# EAGLE design nled-triangle-ap102-pixel-panel-v1a (EAGLE 8.6.0)
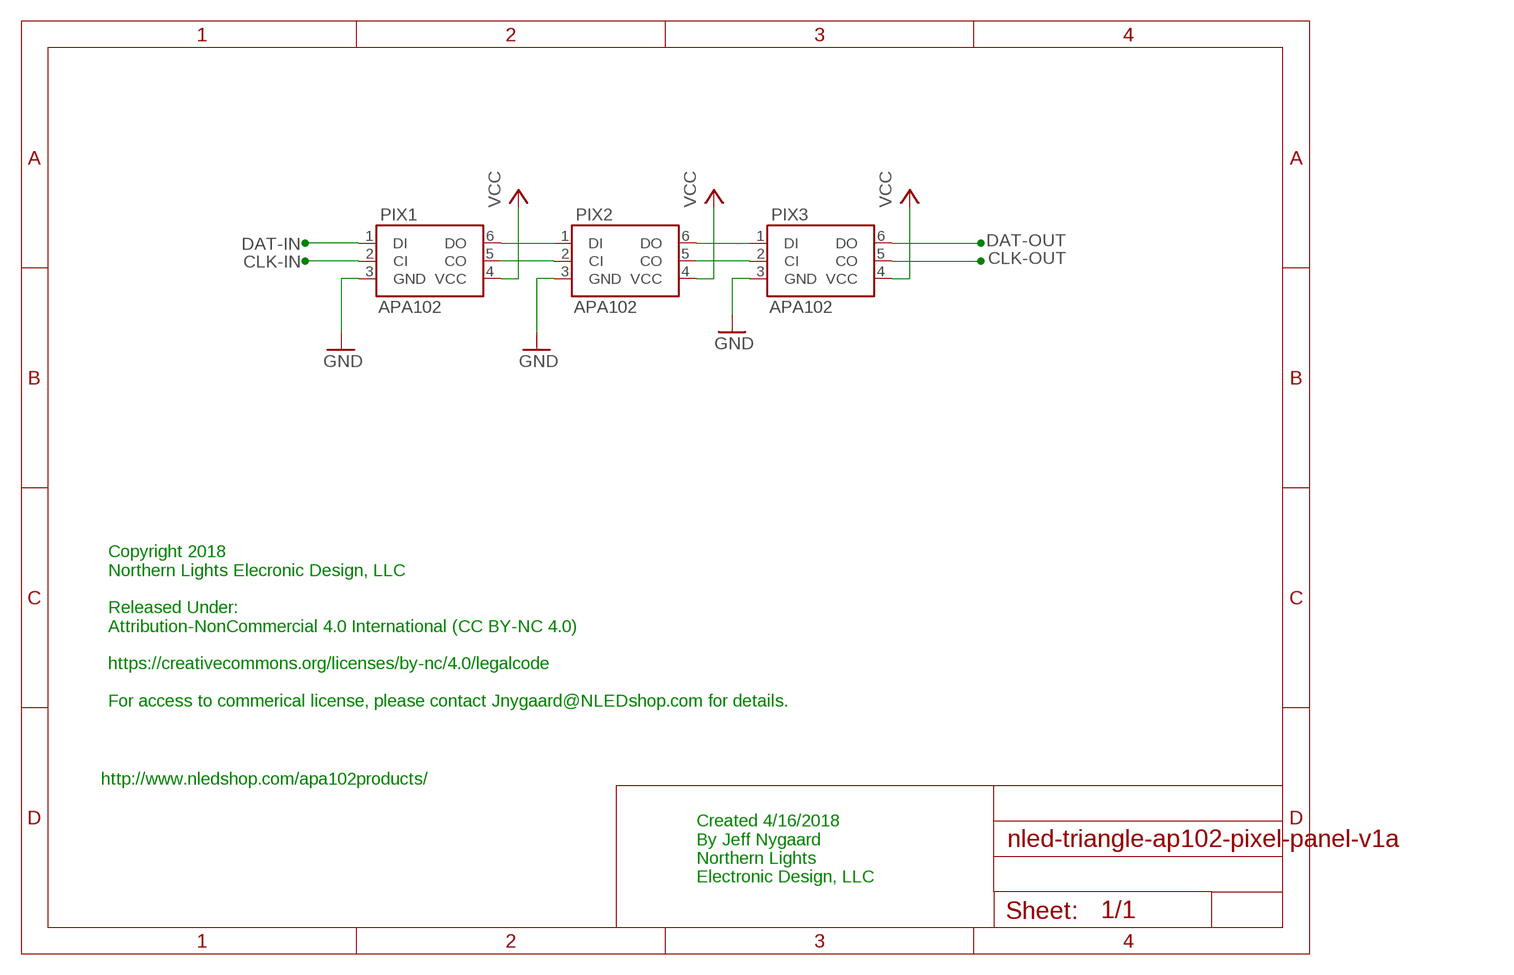
[diagram p0: schematic, sheet 1]

## Parts
PIX1  APA102  [APA102]
PIX2  APA102  [APA102]
PIX3  APA102  [APA102]

## Nets
CLK-IN: PIX1.2(CI)
CLK-OUT: PIX3.5(CO)
DAT-IN: PIX1.1(DI)
DAT-OUT: PIX3.6(DO)
GND: PIX1.3(GND) PIX2.3(GND) PIX3.3(GND)
N$1: PIX1.6(DO) PIX2.1(DI)
N$2: PIX1.5(CO) PIX2.2(CI)
N$6: PIX2.6(DO) PIX3.1(DI)
N$7: PIX2.5(CO) PIX3.2(CI)
VCC: PIX1.4(VCC) PIX2.4(VCC) PIX3.4(VCC)

## Notes on the sheet
- Copyright 2018
  Northern Lights Elecronic Design, LLC
  
  Released Under:
  Attribution-NonCommercial 4.0 International (CC BY-NC 4.0)
  
  https://creativecommons.org/licenses/by-nc/4.0/legalcode
  
  For access to commerical license, please contact Jnygaard@NLEDshop.com for details.
- http://www.nledshop.com/apa102products/
- Created 4/16/2018
  By Jeff Nygaard
  Northern Lights
  Electronic Design, LLC

## Library data of the parts
PIX1-PIX3 = ChromationSystems-2:APA102

## Net classes
0 default: width 0.61 mm

## Board
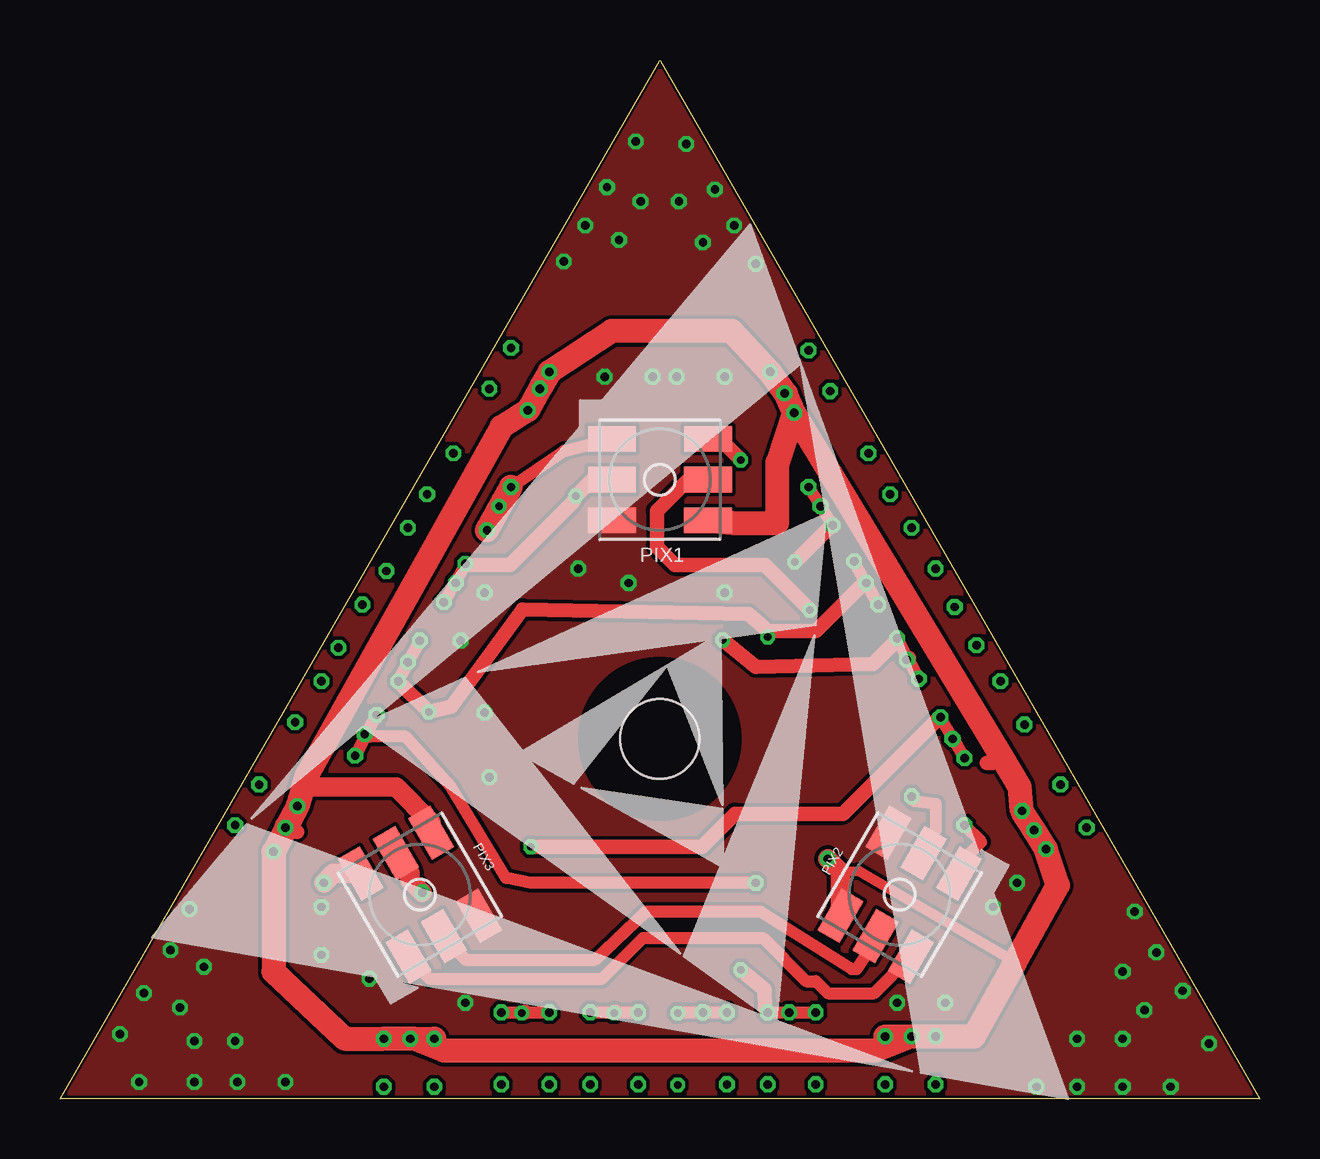
[diagram p1: board, top side]
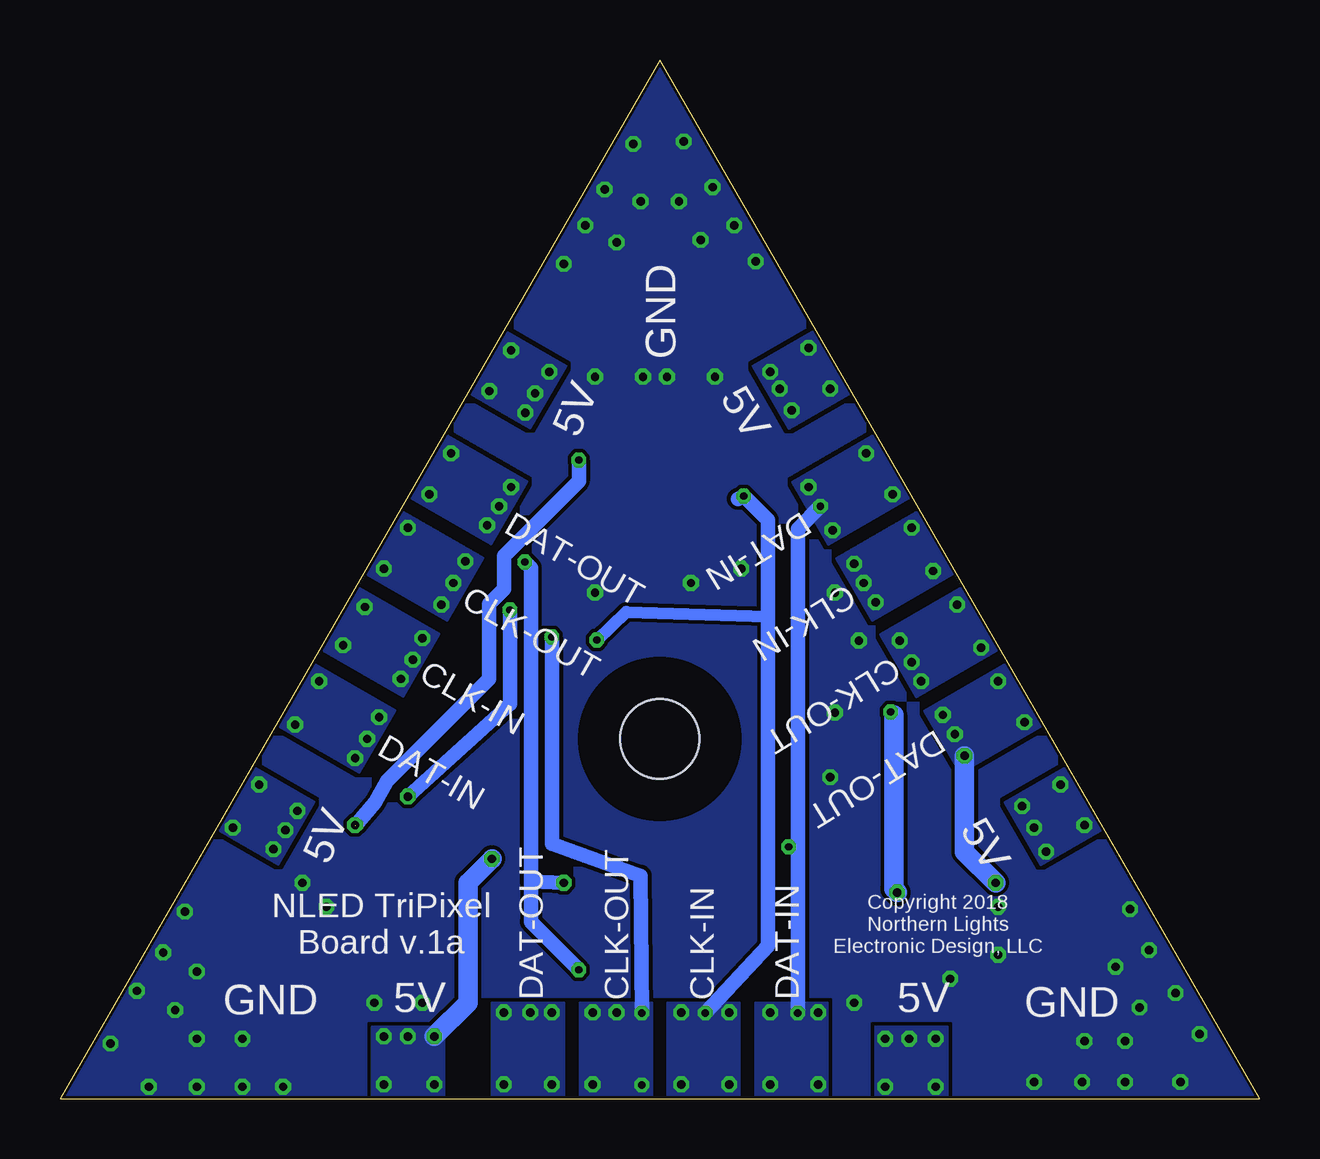
[diagram p2: board, bottom side, seen from below]

Size 50 x 43.3 mm. Coordinates in mm from the lower left corner, seen from the top.
Outline: 25,43.3 50,0 0,0 25,43.3
Copper layers (1*16): Top 0.035mm / dielectric 1.5mm / Bottom 0.035mm
Design rules "SeeedStudio_2layer_DRU_no_angle_20140221 *": minimum track width 6mil, minimum drill 12mil, track to track 6mil, track to pad 6mil, pad to pad 6mil, via to via 6mil, smd to smd 0mil, copper to edge 5mil, drill to drill 10mil, minimum pad ring 10mil, minimum via ring 6mil, stop-mask expansion 2mil, vias tented up to drill 100mil, thermal gap 10mil
Holes 3.3 mm at 25,15
tRestrict: area 21.8,11.8 to 28.2,18.2
bRestrict: area 21.8,11.8 to 28.2,18.2

### Footprints (pad centres in the part's own frame; a part is rotated, then mirrored left to right if it is on the bottom)
APA102 = smd 2 x 1.067: 1 -2,1.7; 2 -2,0; 3 -2,-1.7; 4 2,-1.7; 5 2,0; 6 2,1.7

### Placement (x,y rotation side)
PIX1  25,25.81 0 top
PIX2  35,8.51 240 top
PIX3  15,8.51 120 top

### Tracks (layer width: path | path; a pad name or v marks a point on that pad's centre or on a via)
CLK-IN  (via drill 0.3, 0.35)
  Top 0.508: v16,20.7 16.46,21.52 v16.9,22.3 | v22.1,3.6 23.1,3.6 | 23.12,3.6 v24.1,3.6 | v35.8,17.5 35.34,18.36 v34.9,19.2
  Top 0.61: v35.3,18.3 35.38,18.38 35.34,18.36 | v16.5,21.5 16.46,21.52 | 23.12,3.62 23.1,3.6 | PIX1.2 23,25.88 22.25,25.88 v21.5,25.12 21.38,24.88 18.75,22.25 17.12,22.25 v16.9,22.3 | v27.62,19.12 29,18 33.88,18.12 34.75,19 v34.9,19.2
  Bottom 0.508: v27.62,19.12 26.4,20.3 20.5,20.11
  Bottom 0.61: v23.1,3.58 20.5,6.38 20.5,20.11 20.5,24.12 v21.5,25.12 21.75,25
  other vias: 22.1,0.6 24.1,0.6 38.2,18.9 37.3,20.5 14.5,23.8 13.6,22
  pour Bottom: 24.67,0 21.67,0 21.67,4 24.67,4
  pour Bottom: 37.67,21.37 39.17,18.77 35.7,16.77 34.2,19.37
  pour Bottom: 12.68,21.93 14.18,24.53 17.64,22.53 16.14,19.93
CLK-OUT  (via drill 0.3, 0.35)
  Top 0.508: v14.1,17.4 14.54,18.23 v15,19.1 | 25.8,3.6 v26.8,3.6 26.88,3.6 v27.8,3.6 | v33.1,22.4 v33.6,21.5 v33.61,21.49 v34.1,20.6
  Top 0.61: v26.8,3.6 26.88,3.62 26.88,3.6 | v33.61,21.49 33.62,21.5 v33.6,21.5 33.38,21.38 31.5,19.5 29.5,19.5 | v14.5,18.2 14.5,18.25 14.54,18.23 | v14.1,17.4 v15.38,16.12 16.32,16.35 19.27,20.4 28.7,20.2 29.5,19.5 | v29.5,19.25 29.5,19.5
  Top 0.813: PIX3.5 14,10 14.6,9.4 14.6,9.1 v15.1,8.6
  Bottom 0.61: v15.38,16.12 15.25,16 | v25.75,3.58 25.8,9.3 29.5,10.62 v29.5,19.25
  Bottom 0.813: 15.25,16 15.25,8.75 v15.1,8.6
  other vias: 25.75,0.57 27.8,0.6 36.5,22.1 35.5,23.8 12.6,20.6 11.6,18.8
  pour Bottom: 28.33,0 25.33,0 25.33,4 28.33,4
  pour Bottom: 35.83,24.55 37.33,21.95 33.87,19.95 32.37,22.54
  pour Bottom: 10.84,18.75 12.34,21.35 15.81,19.35 14.31,16.75
DAT-IN  (via drill 0.3, 0.35)
  Top 0.508: v18.8,25.5 21,27 PIX1.1 | v18.4,3.6 19.4,3.6 v20.4,3.6 | v37.7,14.2 37.23,14.99 v36.7,15.9
  Top 0.61: v37.2,15 37.25,15 37.23,14.99 | 19.38,3.62 19.4,3.6 v19.25,3.58 | v19.62,10.5 26.75,10.5 28.12,11.88 32.62,11.88 36.5,15.75 v36.7,15.9
  Top 1: v17.8,23.7 v18.8,25.5
  Bottom 0.61: 19.25,10.5 19.25,23.75 v18.3,24.7 | 19.25,10.5 v19.25,3.58 | v19.62,10.5 19.25,10.5
  other vias: 18.4,0.6 20.4,0.6 40.2,15.6 39.2,17.4 16.4,26.9 15.3,25.2
  pour Bottom: 21,0 18,0 18,4 21,4
  pour Bottom: 39.5,18.19 41,15.6 37.54,13.6 36.04,16.19
  pour Bottom: 14.51,25.1 16.01,27.7 19.47,25.7 17.97,23.1
DAT-OUT  (via drill 0.3, 0.35)
  Top 0.508: 12.79,15.23 v12.3,14.3 | 12.79,15.23 v13.2,16 | v29.5,3.6 30.38,3.6 v30.4,3.6 v31.5,3.6 | v31.2,25.5 31.69,24.71 v31.7,24.7 v32.2,23.9 | v29,9 19.6,9 18.6,9.2 16.3,13 14.4,15.1 12.92,15.1 12.79,15.23
  Top 0.61: v12.7,15.2 12.75,15.25 12.79,15.23 | v31.7,24.7 31.75,24.75 31.69,24.71 | v30.4,3.6 30.38,3.62 30.38,3.6 | 28.38,5.35 29.36,4.56 | 29.36,4.56 29.38,3.75 v29.5,3.6 | v30.62,22.38 32,23.75 v32.2,23.9 | v28.38,5.38 29.36,4.56 | 12.32,14.38 v12.3,14.3
  Top 0.813: PIX3.6 11.39,9.39 v11,9
  Bottom 0.61: v30.62,22.38 30.38,22.12 30.38,9.06 | 30.38,9.06 30.38,7.38 v28.38,5.38 | v29,9 30.38,9.06
  Bottom 0.813: v12.3,14.3 12.3,10.3 v11,9
  other vias: 29.5,0.6 31.5,0.6 34.6,25.2 33.7,26.9 9.8,15.7 10.9,17.4
  pour Bottom: 32,0 29,0 29,4 32,4
  pour Bottom: 34,27.72 35.5,25.12 32.04,23.12 30.54,25.72
  pour Bottom: 9.01,15.58 10.51,18.18 13.97,16.18 12.47,13.58
GND  (via drill 0.35)
  other vias: 6,5.5 5,3.8 5.6,2.4 7.3,2.4 45.2,3.7 44.3,5.3 44.3,2.5 42.4,2.5 25.8,37.4 26.8,35.7 24.2,37.4 23.3,35.8 10.9,8 10.9,6 12.9,5 38.9,8 39.9,9 22.7,30.1 24.7,30.1 25.7,30.1 27.7,30.1 17.7,16.1 17.9,13.4 27.7,21.1 34.9,4 40.7,0.5 44.3,0.5 42.4,0.5 46.3,0.5 46.8,4.5 45.7,6.1 44.8,7.8 47.9,2.3 21,34.9 21.9,36.4 22.8,38 27.3,37.9 28.1,36.4 29,34.8 26.1,39.8 24,39.9 5.4,7.9 9.4,0.7 7.4,0.7 5.6,0.7 3.5,4.4 4.6,6.2 2.5,2.7 3.3,0.7 17.7,21.1 16.7,19.1 21.6,22.1 23.7,21.5 16.9,4 36.9,4
  pour Bottom (no thermals): 5.2,3 7.6,7.16 5,8.66 1.73,3 0,0 3.46,0 10,0 10,3
  pour Bottom: 44.8,3 42.4,7.16 45,8.66 48.27,3 50,0 46.54,0 40,0 40,3
  pour Bottom: 25,37.3 27.4,33.14 30,34.64 26.73,40.3 25,43.3 23.27,40.3 20,34.64 22.6,33.14
  pour Bottom (rank 2, no thermals): 0,0 51,0 25,43
  pour Top (rank 2, no thermals): 0,0 51,0 25,43
N$1  (via drill 0.3, 0.35)  (1 unrouted)
  Top 0.508: PIX2.1 37.47,9.77 38.4,10.7 v37.7,11.4
  Top 0.61: v28.38,26.62 27.5,27.5 PIX1.6
  Bottom 0.61: 37.7,11.38 36.88,12.35 36.38,13.25 32.12,17.5 32.12,20.62 31.5,21.25 31.5,22.62 28.38,25.75 v28.38,26.62
N$2  (via drill 0.3, 0.35)
  Top 0.508: PIX2.2 36,10.7 36.5,11.2 36.5,12.3 35.6,12.4 v35.5,12.6
  Top 0.61: v31.25,20.38 29.38,22.25 25.62,22.25 24.88,23 24.88,24.5 26.25,25.88 27,25.88 PIX1.5
  Bottom 0.61: v35.5,12.6 31.25,16.45 v31.25,20.38
N$6
  Top 0.508: PIX3.1 14.53,5.87 15.4,5 22.6,5 24.3,6.7 29.3,6.7 31.1,4.9 31.5,4.9 32,4.4 33.94,4.4 PIX2.6
N$7
  Top 0.508: PIX3.2 16,6.7 16.9,5.8 22.3,5.8 24.4,7.8 29.2,7.8 33,5.4 33.2,5.4 34,6.6 PIX2.5
VCC  (via drill 0.35)
  Top 0.406: 32.53,9.47 33.3,9.5 39.83,5.71
  Top 0.61: 38.62,14 38.88,14 39.27,14.23 | v9.4,11.3 9.38,11.38 9.45,11.34 | v20,29.6 20,29.62 20.02,29.62 | v40.6,11.2 40.62,11.25 40.59,11.22 | v30.2,29.4 30.25,29.38 30.26,29.38 | 9.88,11.12 9.45,11.35
  Top 0.813: PIX3.4 15.47,11.53 14,13 10.25,13 10.1,12.85 | PIX2.4 32.53,9.47 v32,10
  Top 1: 14.74,2.5 v15.6,2.5 | 14.74,2.5 v14.6,2.5 v13.5,2.5 11.87,2.5 8.9,5.3 v8.9,10.3 9.45,11.34 9.45,11.35 v9.9,12.2 10.1,12.85 10.3,13.5 18.4,28 v19.5,28.7 20.02,29.62 v20.4,30.3 23,32 28,32 v29.6,30.3 30.26,29.38 v30.6,28.6 | v34.4,2.6 v35.5,2.6 | v35.5,2.6 v36.5,2.6 38.1,2.6 39.83,5.71 41.6,8.9 v41.1,10.4 v40.6,11.2 40.59,11.22 v40.1,12 40,13 39.27,14.23 v30.6,28.6 | v30.6,28.6 29.9,26.5 29.9,24 28,24 PIX1.4 | v35.5,2.6 34,2 16,2 14.74,2.5
  Bottom 0.813: v34.4,2.6 33,4 33,9 v32,10
  other vias: 13.5,0.5 15.6,0.5 34.4,0.6 36.5,0.6 42.8,11.3 41.7,13.1 32.1,29.5 31.2,31.2 18.8,31.3 17.9,29.6 8.3,13.1 7.3,11.4
  pour Bottom: 6.51,11.25 8.01,13.85 10.61,12.35 9.11,9.75
  pour Bottom: 37,0 34,0 34,3 37,3
  pour Bottom: 16,0 13,0 13,3 16,3
  pour Bottom: 42,13.86 43.5,11.27 40.9,9.77 39.4,12.36
  pour Bottom: 31.5,32.05 33,29.45 30.4,27.95 28.9,30.55
  pour Bottom: 17.01,29.43 18.51,32.03 21.11,30.53 19.61,27.93

### Text on the board
bNames: GND | 5V | 5V | DAT-OUT / CLK-OUT / CLK-IN / DAT-IN | DAT-OUT / CLK-OUT / CLK-IN / DAT-IN | 5V | 5V | Copyright 2018 / Northern Lights / Electronic Design, LLC | NLED TriPixel / Board v.1a | 5V | DAT-OUT / CLK-OUT / CLK-IN / DAT-IN | 5V | GND | GND